# EAGLE schematic pyPhotometry_1.0.2 (EAGLE 6.6.0)
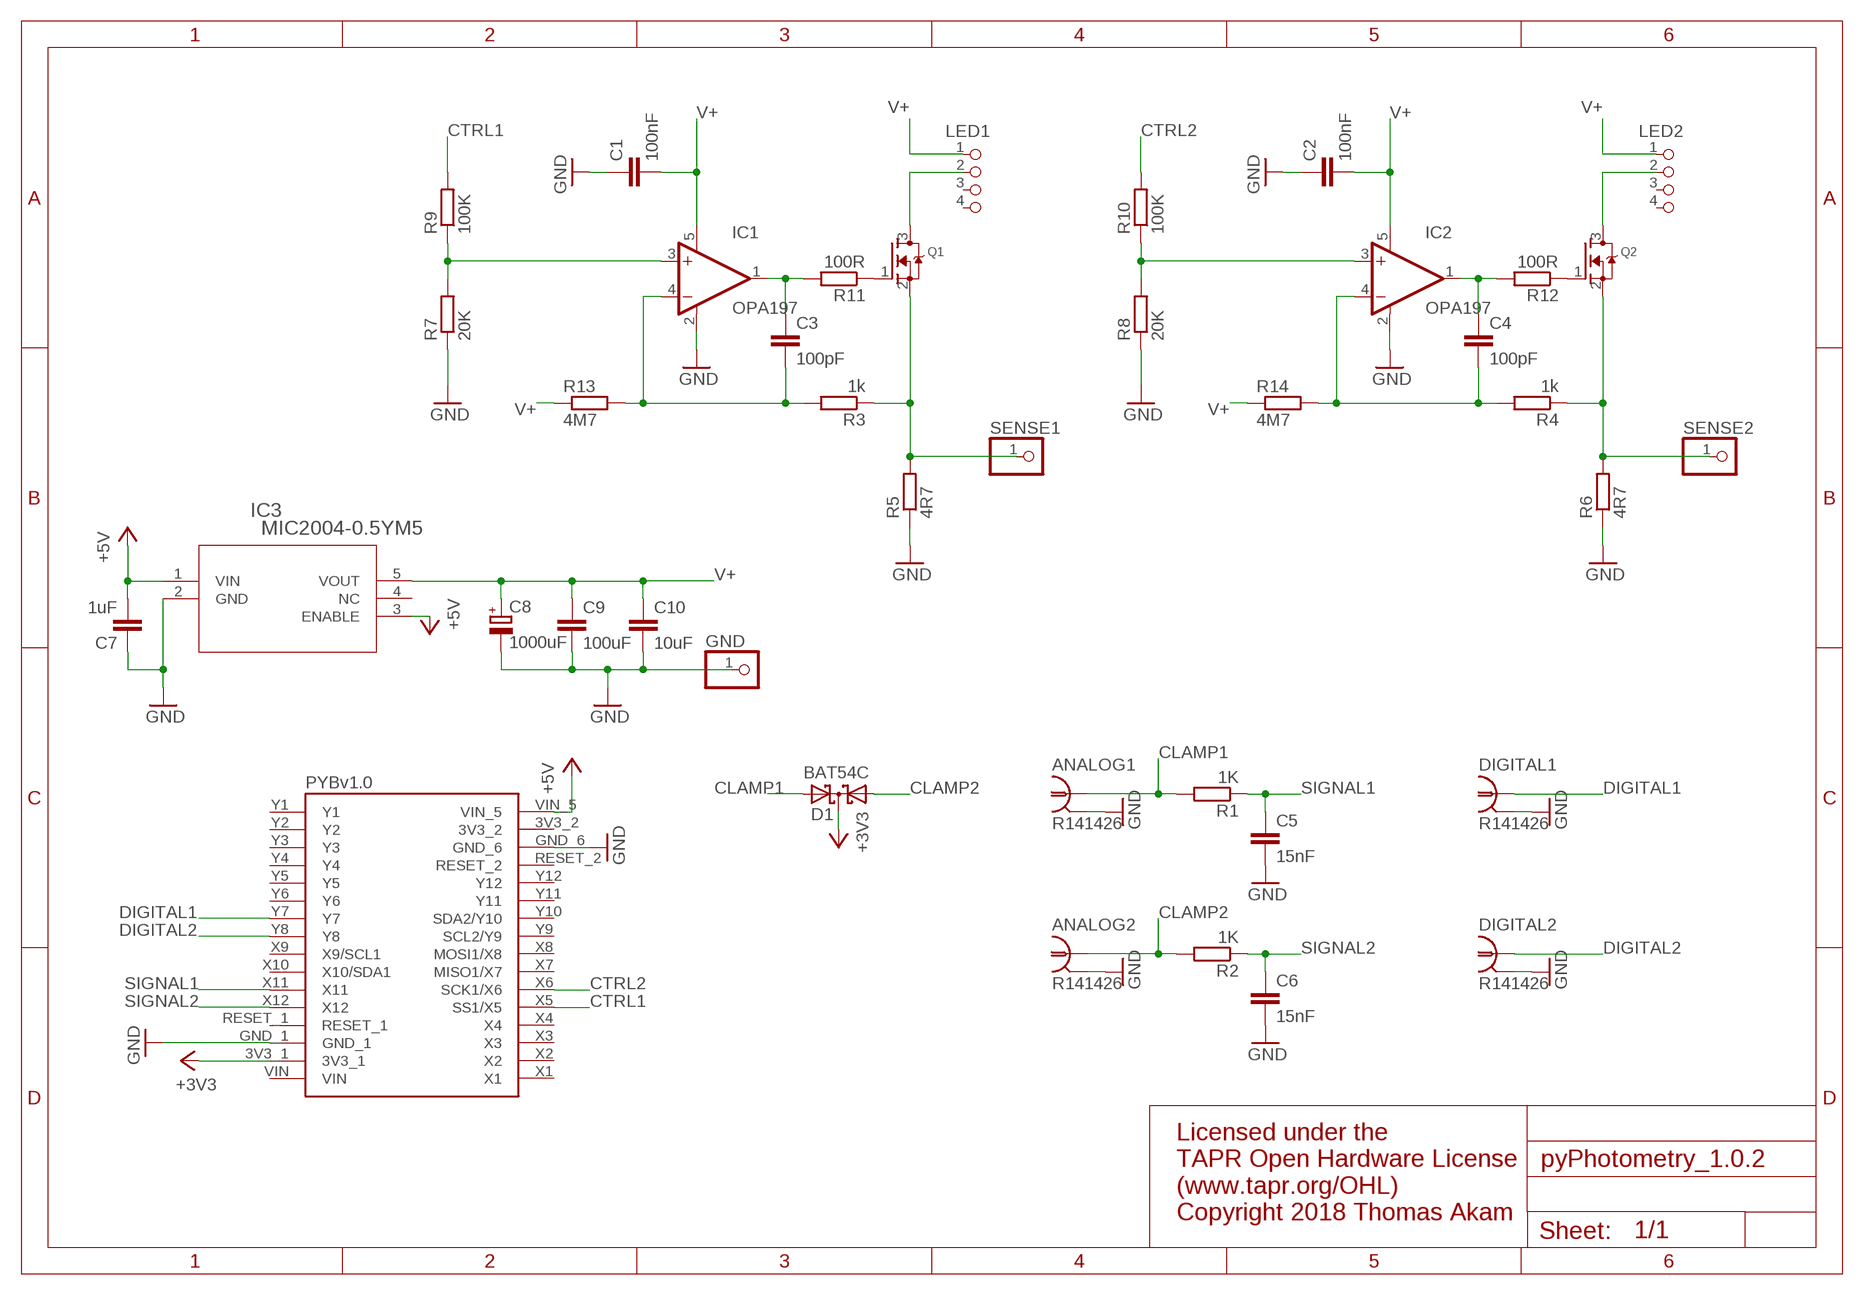
[diagram p0: schematic, sheet 1]

## Parts
ANALOG1  R141426  [R141426]
ANALOG2  R141426  [R141426]
C1  100nF  C-EUC0805  [C0805]
C2  100nF  C-EUC0805  [C0805]
C3  100pF  C-EUC0805  [C0805]
C4  100pF  C-EUC0805  [C0805]
C5  15nF  C-EUC0805  [C0805]
C6  15nF  C-EUC0805  [C0805]
C7  1uF  C-EUC0805  [C0805]
C8  1000uF  CPOL-EU153CLV-0807  [153CLV-0807]
C9  100uF  C-EUC1206  [C1206]
C10  10uF  C-EUC1206  [C1206]
D1  BAT54C  [SOT23]
DIGITAL1  R141426  [R141426]
DIGITAL2  R141426  [R141426]
GND  PINHD-1X1  [1X01]
IC1  OPA197  [SOT23-5]
IC2  OPA197  [SOT23-5]
IC3  MIC2004-0.5YM5  [SOT-23-5_M5]
LED1  M8-4  [M8-4]
LED2  M8-4  [M8-4]
Q1  MOSFET-NREFLOW  [SOT23]
Q2  MOSFET-NREFLOW  [SOT23]
R1  1K  R-EU_M0805  [M0805]
R2  1K  R-EU_M0805  [M0805]
R3  1k  R-EU_R0805  [R0805]
R4  1k  R-EU_R0805  [R0805]
R5  4R7  R-EU_M0805  [M0805]
R6  4R7  R-EU_M0805  [M0805]
R7  20K  R-EU_R0805  [R0805]
R8  20K  R-EU_R0805  [R0805]
R9  100K  R-EU_R0805  [R0805]
R10  100K  R-EU_R0805  [R0805]
R11  100R  R-EU_R0805  [R0805]
R12  100R  R-EU_R0805  [R0805]
R13  4M7  R-EU_M0805  [M0805]
R14  4M7  R-EU_M0805  [M0805]
SENSE1  PINHD-1X1  [1X01]
SENSE2  PINHD-1X1  [1X01]
U$1  PYBOARD-REDUCED-3  [PYBOARD-REDUCED-3]

## Nets
+3V3: D1.3(CC) U$1.3V3_1
+5V: C7.2 IC3.1(VIN) IC3.3(ENABLE) U$1.VIN_5
CLAMP1: ANALOG1.1 D1.2(A2) R1.2
CLAMP2: ANALOG2.1 D1.1(A1) R2.2
CTRL1: R9.2 U$1.X5(SS1/X5)
CTRL2: R10.2 U$1.X6(SCK1/X6)
DIGITAL1: DIGITAL1.1 U$1.Y7
DIGITAL2: DIGITAL2.1 U$1.Y8
GND: ANALOG1.2(GND) ANALOG2.2(GND) C1.1 C2.1 C5.2 C6.2 C7.1 C8.- C9.2 C10.2 DIGITAL1.2(GND) DIGITAL2.2(GND) GND.1 IC1.2(V-) IC2.2(V-) IC3.2(GND) R5.1 R6.1 R7.1 R8.1 U$1.GND_1 U$1.GND_6
N$1: C3.1 IC1.1(OUT) R11.2
N$2: C3.2 IC1.4(-IN) R3.2 R13.2
N$3: IC1.3(+IN) R7.2 R9.1
N$7: Q1.1(G) R11.1
N$8: LED1.2 Q1.3(D)
N$9: Q1.2(S) R3.1 R5.2 SENSE1.1
N$11: C4.1 IC2.1(OUT) R12.2
N$12: Q2.2(S) R4.1 R6.2 SENSE2.1
N$13: C4.2 IC2.4(-IN) R4.2 R14.2
N$14: IC2.3(+IN) R8.2 R10.1
N$15: Q2.1(G) R12.1
N$16: LED2.2 Q2.3(D)
SIGNAL1: C5.1 R1.1 U$1.X11
SIGNAL2: C6.1 R2.1 U$1.X12
V+: C1.2 C2.2 C8.+ C9.1 C10.1 IC1.5(V+) IC2.5(V+) IC3.5(VOUT) LED1.1 LED2.1 R13.1 R14.1
Unconnected: IC3.4(NC) LED1.3 LED1.4 LED2.3 LED2.4 U$1.3V3_2 U$1.RESET_1 U$1.RESET_2 U$1.VIN U$1.X1 U$1.X2 U$1.X3 U$1.X4 U$1.X7(MISO1/X7) U$1.X8(MOSI1/X8) U$1.X9(X9/SCL1) U$1.X10(X10/SDA1) U$1.Y1 U$1.Y2 U$1.Y3 U$1.Y4 U$1.Y5 U$1.Y6 U$1.Y9(SCL2/Y9) U$1.Y10(SDA2/Y10) U$1.Y11 U$1.Y12

## Notes on the sheet
- Licensed under the 
  TAPR Open Hardware License
  (www.tapr.org/OHL)
  Copyright 2018 Thomas Akam

## Power pins joined to a net without a drawn wire
GND: ANALOG1.3(GND) ANALOG1.4(GND) ANALOG1.5(GND) ANALOG2.3(GND) ANALOG2.4(GND) ANALOG2.5(GND) DIGITAL1.3(GND) DIGITAL1.4(GND) DIGITAL1.5(GND) DIGITAL2.3(GND) DIGITAL2.4(GND) DIGITAL2.5(GND)

## Library data of the parts
ANALOG1 ANALOG2 DIGITAL1 DIGITAL2 = con-coax:R141426: BNC COAX CONNECTOR Radiall 50/75 Ohm Spoerle; MF: FARNELL; MPN: R141426161; OC_FARNELL: 4195115; OC_NEWARK: 14J7919
C1-C7 C9 C10 = rcl:C-EU: CAPACITOR, European symbol
C8 = rcl:CPOL-EU: POLARIZED CAPACITOR, European symbol
D1 = diode:BAT54C: Schottky Diodes Source: Fairchild .. BAT54.pdf
GND SENSE1 SENSE2 = adafruit:PINHD-1X1: Pin header 1x1 for 0.1" spacing With round pins
IC1 IC2 = burr-brown:OPA197
IC3 = MIC2004:MIC2004-0.5YM5; MANUFACTURER_PART_NUMBER: MIC20040.5YM5; VENDOR: Micrel
LED1 LED2 = pinhead:M8-4
Q1 Q2 = adafruit:MOSFET-N: N-Channel Mosfet 2N7002E - 60V 260mA SOT23 [Digikey: 2N7002ET1GOSTR-ND] - REEL BSH103 - 30V 850mA SOT23 [Digikey: 568-5013-1-ND]
R1-R14 = resistor:R-EU_: RESISTOR, European symbol
U$1 = micropython:PYBOARD-REDUCED-3